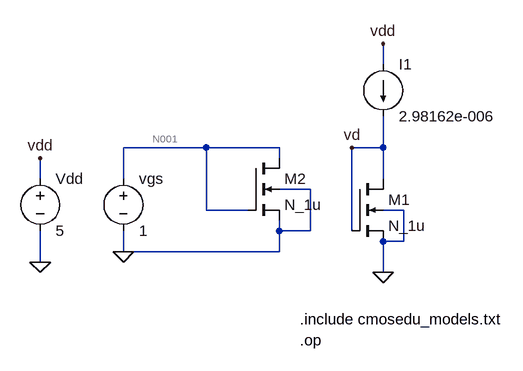
[diagram p0: schematic pt3.asc]
pt3.asc, the LTspice schematic file:
Version 4
SHEET 1 880 680
WIRE 176 -48 176 -80
WIRE -96 80 -224 80
WIRE 16 80 -96 80
WIRE 176 80 176 32
WIRE 176 80 128 80
WIRE 16 96 16 80
WIRE -352 128 -352 96
WIRE -224 128 -224 80
WIRE 176 128 176 80
WIRE 64 144 16 144
WIRE -96 176 -96 80
WIRE -32 176 -96 176
WIRE 208 176 176 176
WIRE 16 208 16 192
WIRE 64 208 64 144
WIRE 64 208 16 208
WIRE 128 208 128 80
WIRE 208 224 208 176
WIRE 208 224 176 224
WIRE -224 240 -224 208
WIRE 16 240 16 208
WIRE 16 240 -224 240
WIRE -352 256 -352 208
WIRE 176 272 176 224
FLAG 176 272 0
FLAG 176 -80 vdd
FLAG -352 256 0
FLAG -352 96 vdd
FLAG -224 240 0
FLAG 128 80 vd
SYMBOL nmos4 128 128 R0
SYMATTR InstName M1
SYMATTR Value N_1u
SYMATTR Value2 l=1.5u w=3u
SYMBOL current 176 -48 R0
WINDOW 123 0 0 Left 2
WINDOW 39 0 0 Left 2
SYMATTR InstName I1
SYMATTR Value 2.98162e-006
SYMBOL voltage -352 112 R0
WINDOW 123 0 0 Left 2
WINDOW 39 0 0 Left 2
SYMATTR InstName Vdd
SYMATTR Value 5
SYMBOL voltage -224 112 R0
SYMATTR InstName vgs
SYMATTR Value 1
SYMBOL nmos4 -32 96 R0
SYMATTR InstName M2
SYMATTR Value N_1u
SYMATTR Value2 l=1.5u w=3u
TEXT 48 344 Left 2 !.include cmosedu_models.txt
TEXT 48 376 Left 2 !.op

The netlist it stands for:
* pt3.asc
M1 vd vd 0 0 N_1u l=1.5u w=3u
I1 vdd vd 2.98162e-006
Vdd vdd 0 5
vgs N001 0 1
M2 N001 N001 0 0 N_1u l=1.5u w=3u
.model NMOS NMOS
.model PMOS PMOS
.lib standard.mos
.include cmosedu_models.txt
.op
.backanno
.end

* Results of the author's LTspice run, read from the files saved beside the schematic
* Operating Point:
*   V(vd) = 1 V
*   V(vdd) = 5 V
*   V(n001) = 1 V
*   Id(M2) = 2.982 µA
*   Ig(M2) = 0 A
*   Ib(M2) = -1.01 pA
*   Is(M2) = -2.982 µA
*   Id(M1) = 2.982 µA
*   Ig(M1) = 0 A
*   Ib(M1) = -1.01 pA
*   Is(M1) = -2.982 µA
*   I(I1) = 2.982 µA
*   I(Vgs) = -2.982 µA
*   I(Vdd) = -2.982 µA
* From the log:
*   Semiconductor Device Operating Points:
*                           --- MOSFET Transistors ---
*   Name:          m2          m1
*   Model:        n_1u        n_1u
*   Id:          2.98e-06    2.98e-06
*   Vgs:         1.00e+00    1.00e+00
*   Vds:         1.00e+00    1.00e+00
*   Vbs:         0.00e+00    0.00e+00
*   Vth:         8.90e-01    8.90e-01
*   Vdsat:       1.32e-01    1.32e-01
*   Gm:          3.43e-05    3.43e-05
*   Gds:         1.49e-07    1.49e-07
*   Gmb:         1.20e-05    1.20e-05
*   Cbd:         0.00e+00    0.00e+00
*   Cbs:         0.00e+00    0.00e+00
*   Cgsov:       6.00e-16    6.00e-16
*   Cgdov:       6.00e-16    6.00e-16
*   Cgbov:       1.30e-16    1.30e-16
*   Cgs:         4.49e-15    4.49e-15
*   Cgd:         0.00e+00    0.00e+00
*   Cgb:         0.00e+00    0.00e+00